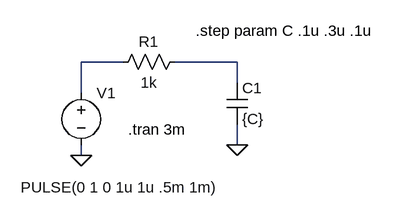
[diagram p0: schematic paramatric_analysis2.asc]
paramatric_analysis2.asc, the LTspice schematic file:
Version 4
SHEET 1 880 680
WIRE 32 128 -32 128
WIRE 208 128 112 128
WIRE 208 160 208 128
WIRE -32 176 -32 128
WIRE 208 256 208 224
WIRE -32 272 -32 256
FLAG 208 256 0
FLAG -32 272 0
SYMBOL voltage -32 160 R0
WINDOW 3 -93 161 Left 2
WINDOW 123 0 0 Left 0
WINDOW 39 0 0 Left 0
SYMATTR InstName V1
SYMATTR Value PULSE(0 1 0 1u 1u .5m 1m)
SYMBOL res 128 112 R90
WINDOW 0 0 56 VBottom 2
WINDOW 3 32 56 VTop 2
SYMATTR InstName R1
SYMATTR Value 1k
SYMBOL cap 192 160 R0
SYMATTR InstName C1
SYMATTR Value {C}
TEXT 40 232 Left 2 !.tran 3m
TEXT 144 80 Left 2 !.step param C .1u .3u .1u

The netlist it stands for:
* paramatric_analysis2.asc
V1 N001 0 PULSE(0 1 0 1u 1u .5m 1m)
R1 N002 N001 1k
C1 N002 0 {C}
.tran 3m
.step param C .1u .3u .1u
.backanno
.end